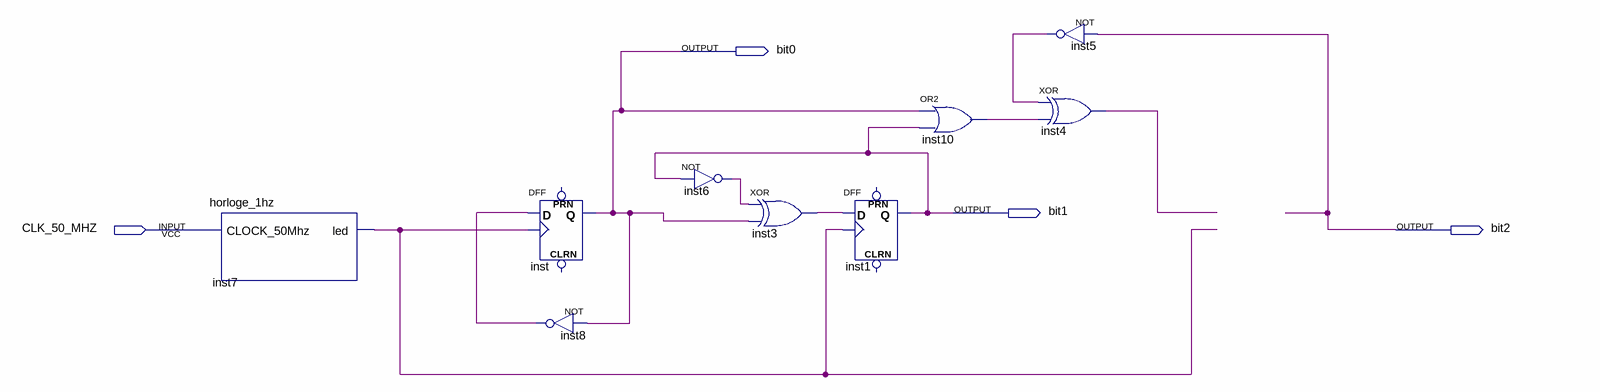
[diagram p0: schematic sheet]
// Quartus schematic decompteur_modulo_8.bdf as structural Verilog: 9 symbols, 4 pins
module decompteur_modulo_8 (
  input  CLK_50_MHZ,
  output bit0,
  output bit1,
  output bit2
);

  wire inst3_out, inst4_out, inst5_out, inst6_out, inst7_led, inst8_out, inst10_out;

  horloge_1hz inst7 (.CLOCK_50Mhz(CLK_50_MHZ), .led(inst7_led));
  DFF inst (.CLK(inst7_led), .D(inst8_out), .Q(bit0));  // open: CLRN, PRN
  not inst8 (inst8_out, bit0);
  not inst6 (inst6_out, bit1);
  xor inst3 (inst3_out, inst6_out, bit0);
  DFF inst1 (.CLK(inst7_led), .D(inst3_out), .Q(bit1));  // open: CLRN, PRN
  or inst10 (inst10_out, bit0, bit1);
  not inst5 (inst5_out, bit2);
  xor inst4 (inst4_out, inst5_out, inst10_out);
endmodule
